# Altium project DB32.PRJPCB
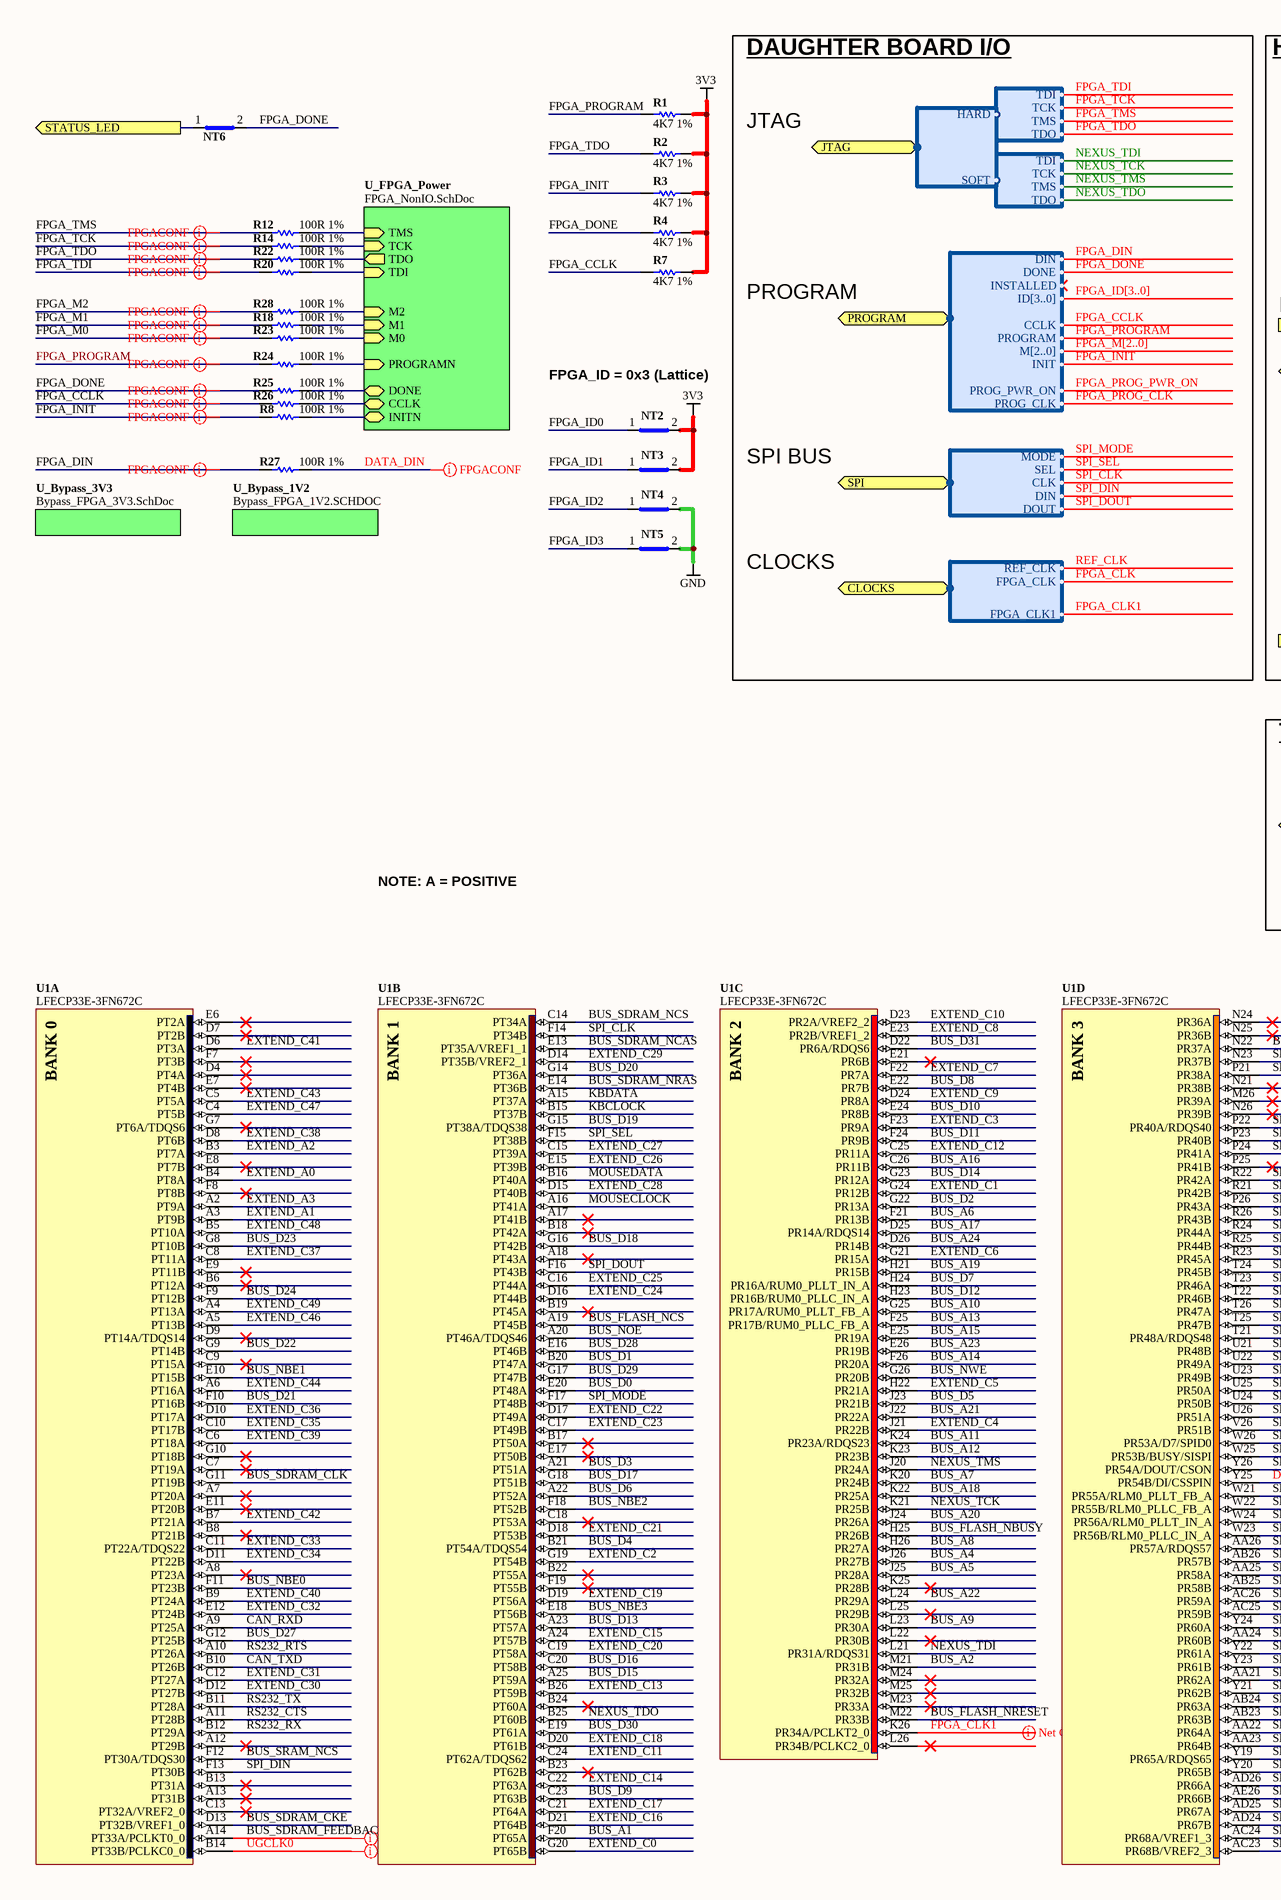
[diagram p0: FPGA.SCHDOC, left]
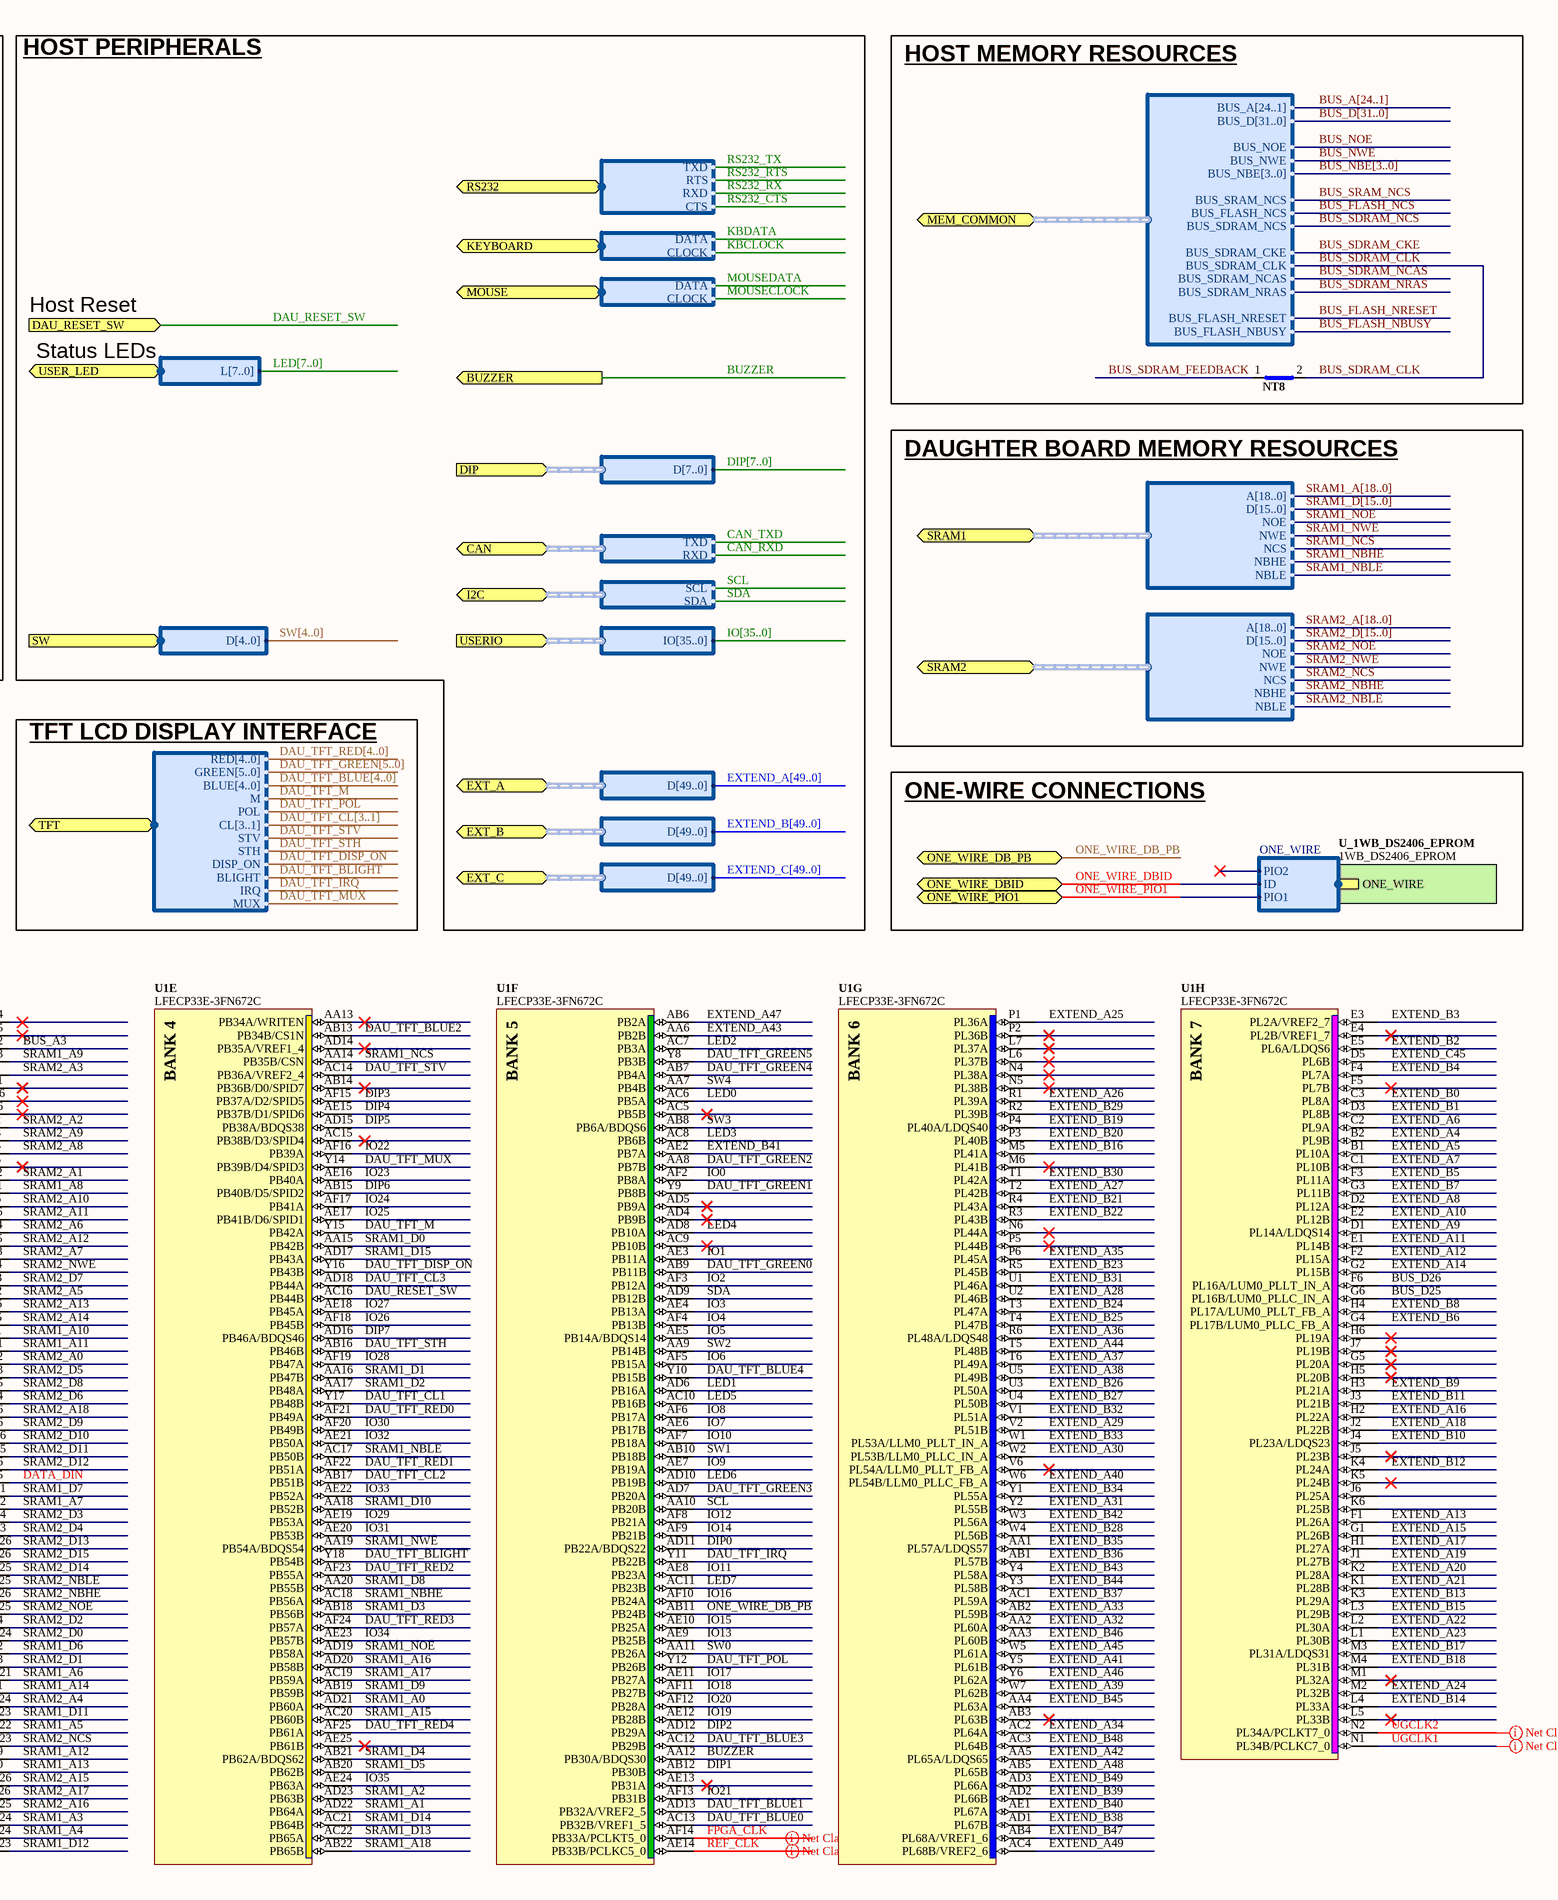
[diagram p1: FPGA.SCHDOC, right]
ProjectAddress1: L3, 12A Rodborough Road; ProjectAddress2: Frenchs Forest; ProjectAddress3: NSW 2086; ProjectAddress4: Australia; ProjectAssyNum: D-820-0006; ProjectOrganization: Altium Limited; ProjectRevision: 08; ProjectTitle: DB32 - Daughter Board Lattice; ProjectTotalSheets: 19
3 sheets, 96 parts. Net scope: hierarchical (ports join the sheet entries above them; power ports are global).
Board files: DB32.PcbDoc, DB32_Panel.PcbDoc
Sheets:
  FPGA.SCHDOC
    U_FPGA_Power = FPGA_NonIO.SchDoc
    U_Bypass_3V3 = Bypass_FPGA_3V3.SchDoc

## Sheet FPGA.SCHDOC: FPGA Connections
size A2; Organization: Altium Limited.; Address1: Level 3, 12a Rodborough Rd; Address2: Frenchs Forest 2086; Address3: NSW; Address4: AUSTRALIA; DocumentNumber: 3; SheetNumber: 4; SheetTotal: 21; PageSetup: Record=PageOptions|CenterHorizontal=True|CenterVertical=True|PrintScale=0.49|XCorrection=1.00|YCorrection=1.00|PrintKind=2|BorderSize=5000000|LeftOffset=0|BottomOffset=0|Orientation=2|PaperLength=1000|PaperWidth=1000|Scale=100|PaperSource=15|PrintQuality=600|MediaType=1|DitherType=10|PaperKind=A4|PrintScaleMode=1

### Parts
NT2  Net Tie SMT2  [NETTIE-SMT2-8X8]  (value not drawn)  (net tie, no BOM)
NT3  Net Tie SMT2  [NETTIE-SMT2-8X8]  (value not drawn)  (net tie, no BOM)
NT4  Net Tie SMT2  [NETTIE-SMT2-8X8]  (value not drawn)  (net tie, no BOM)
NT5  Net Tie SMT2  [NETTIE-SMT2-8X8]  (value not drawn)  (net tie, no BOM)
NT6  Net Tie SMT2  [NETTIE-SMT2-8X8]  (value not drawn)  (net tie, no BOM)
NT8  Net Tie SMT2  [NETTIE-SMT2-8X8]  (value not drawn)  (net tie, no BOM)
R1  4K7 1%  [RESC1005-STAR]
R2  4K7 1%  [RESC1005-STAR]
R3  4K7 1%  [RESC1005-STAR]
R4  4K7 1%  [RESC1005-STAR]
R7  4K7 1%  [RESC1005-STAR]
R8  100R 1%  [RESC1005-STAR]
R12  100R 1%  [RESC1005-STAR]
R14  100R 1%  [RESC1005-STAR]
R18  100R 1%  [RESC1005-STAR]
R20  100R 1%  [RESC1005-STAR]
R22  100R 1%  [RESC1005-STAR]
R23  100R 1%  [RESC1005-STAR]
R24  100R 1%  [RESC1005-STAR]
R25  100R 1%  [RESC1005-STAR]
R26  100R 1%  [RESC1005-STAR]
R27  100R 1%  [RESC1005-STAR]
R28  100R 1%  [RESC1005-STAR]
U1  LFECP33E-3FN672C  [BGA100P26X26-672]  (parts A,B,C,D,E,F,G,H of 12)

### Blocks framed on the sheet
HOST MEMORY RESOURCES: NT8

### Sub-sheets
U_1WB_DS2406_EPROM = 1WB_DS2406_EPROM (file not in this document): ONE_WIRE (harness ONE_WIRE)
U_Bypass_1V2 = Bypass_FPGA_1V2.SCHDOC (file not in this document): no entries
U_Bypass_3V3 = Bypass_FPGA_3V3.SchDoc: no entries
U_FPGA_Power = FPGA_NonIO.SchDoc: TMS (in), DONE (bidir), M1 (in), CCLK (bidir), M0 (in), M2 (in), TCK (in), INITN (bidir), TDI (in), PROGRAMN (in), TDO (out)

### Ports
BUZZER (out), CAN (harness CAN_INT), CLOCKS (harness DAU_CLK), DAU_RESET_SW (in), DIP (harness SW8), EXT_A (harness PBIO), EXT_B (harness PBIO), EXT_C (harness PBIO), I2C (harness I2C), JTAG (harness HARDSOFT_JTAG), KEYBOARD (harness PS2), MEM_COMMON (harness HOSTMEMORY), MOUSE (harness PS2), ONE_WIRE_DB_PB (bidir), ONE_WIRE_DBID (bidir), ONE_WIRE_PIO1 (bidir), PROGRAM (harness DAU_CTRL), RS232 (harness RS232_INT), SPI (harness DAU_SPI), SRAM1 (harness SRAM-256Kx16), SRAM2 (harness SRAM-256Kx16), STATUS_LED (out), SW (harness SW5), TFT (harness DAU_TFT), USER_LED (harness LED8), USERIO (harness IO36)

### Harnesses
ONE_WIRE: ID, PIO1, PIO2
SRAM-256Kx16: A[18..0], D[15..0], NCS, NWE, NOE, NBHE, NBLE
HOSTMEMORY: BUS_A[24..1], BUS_D[31..0], BUS_NOE, BUS_NWE, BUS_NBE[3..0], BUS_SRAM_NCS, BUS_FLASH_NCS, BUS_SDRAM_NCS, BUS_SDRAM_CKE, BUS_SDRAM_CLK, BUS_SDRAM_NCAS, BUS_SDRAM_NRAS, BUS_FLASH_NRESET, BUS_FLASH_NBUSY
DAU_CLK: REF_CLK, FPGA_CLK, FPGA_CLK1
DAU_SPI: MODE, SEL, CLK, DIN, DOUT
DAU_CTRL: DIN, DONE, INSTALLED, ID[3..0], CCLK, PROGRAM, M[2..0], INIT, PROG_PWR_ON, PROG_CLK
JTAG: TMS, TDO, TDI, TCK
HARDSOFT_JTAG: HARD, SOFT
LED8: L[7..0]
SW5: D[4..0]
DAU_TFT: RED[4..0], GREEN[5..0], BLUE[4..0], M, POL, CL[3..1], STV, STH, DISP_ON, BLIGHT, IRQ, MUX
PS2: DATA, CLOCK
RS232_INT: RXD, TXD, RTS, CTS
IO36: IO[35..0]
SW8: D[7..0]
CAN_INT: TXD, RXD
I2C: SCL, SDA
PBIO: D[49..0]

### Nets
3V3: NT2.2(Net2) NT3.2(Net2) R1.2 R2.2 R3.2 R4.2 R7.2
GND: NT4.2(Net2) NT5.2(Net2)
BUS_A1: U1.F20(PT65A)
BUS_A2: U1.M21(PR31B)
BUS_A3: U1.N22(PR37A)
BUS_A4: U1.J26(PR27B)
BUS_A5: U1.J25(PR28A)
BUS_A6: U1.F21(PR13B)
BUS_A7: U1.K20(PR24B)
BUS_A8: U1.H26(PR27A)
BUS_A9: U1.L23(PR30A)
BUS_A10: U1.G25(PR17A/RUM0_PLLT_FB_A)
BUS_A11: U1.K24(PR23A/RDQS23)
BUS_A12: U1.K23(PR23B)
BUS_A13: U1.F25(PR17B/RUM0_PLLC_FB_A)
BUS_A14: U1.F26(PR20A)
BUS_A15: U1.E25(PR19A)
BUS_A16: U1.C26(PR11B)
BUS_A17: U1.D25(PR14A/RDQS14)
BUS_A18: U1.K22(PR25A)
BUS_A19: U1.H21(PR15B)
BUS_A20: U1.J24(PR26A)
BUS_A21: U1.J22(PR22A)
BUS_A22: U1.L24(PR29A)
BUS_A23: U1.E26(PR19B)
BUS_A24: U1.D26(PR14B)
BUS_D0: U1.E20(PT48A)
BUS_D1: U1.B20(PT47A)
BUS_D2: U1.G22(PR13A)
BUS_D3: U1.A21(PT51A)
BUS_D4: U1.B21(PT54A/TDQS54)
BUS_D5: U1.J23(PR21B)
BUS_D6: U1.A22(PT52A)
BUS_D7: U1.H24(PR16A/RUM0_PLLT_IN_A)
BUS_D8: U1.E22(PR7B)
BUS_D9: U1.C23(PT63B)
BUS_D10: U1.E24(PR8B)
BUS_D11: U1.F24(PR9B)
BUS_D12: U1.H23(PR16B/RUM0_PLLC_IN_A)
BUS_D13: U1.A23(PT57A)
BUS_D14: U1.G23(PR12A)
BUS_D15: U1.A25(PT59A)
BUS_D16: U1.C20(PT58B)
BUS_D17: U1.G18(PT51B)
BUS_D18: U1.G16(PT42B)
BUS_D19: U1.G15(PT38A/TDQS38)
BUS_D20: U1.G14(PT36A)
BUS_D21: U1.F10(PT16B)
BUS_D22: U1.G9(PT14B)
BUS_D23: U1.G8(PT10B)
BUS_D24: U1.F9(PT12B)
BUS_D25: U1.G6(PL16B/LUM0_PLLC_IN_A)
BUS_D26: U1.F6(PL16A/LUM0_PLLT_IN_A)
BUS_D27: U1.G12(PT25B)
BUS_D28: U1.E16(PT46B)
BUS_D29: U1.G17(PT47B)
BUS_D30: U1.E19(PT61A)
BUS_D31: U1.D22(PR6A/RDQS6)
BUS_FLASH_NBUSY: U1.H25(PR26B) ; port MEM_COMMON.BUS_FLASH_NBUSY
BUS_FLASH_NCS: U1.A19(PT45B) ; port MEM_COMMON.BUS_FLASH_NCS
BUS_FLASH_NRESET: U1.M22(PR33B) ; port MEM_COMMON.BUS_FLASH_NRESET
BUS_NBE0: U1.F11(PT23B)
BUS_NBE1: U1.E10(PT15B)
BUS_NBE2: U1.F18(PT52B)
BUS_NBE3: U1.E18(PT56B)
BUS_NOE: U1.A20(PT46A/TDQS46) ; port MEM_COMMON.BUS_NOE
BUS_NWE: U1.G26(PR20B) ; port MEM_COMMON.BUS_NWE
BUS_SDRAM_CKE: U1.D13(PT32B/VREF1_0) ; port MEM_COMMON.BUS_SDRAM_CKE
BUS_SDRAM_CLK: NT8.2(Net2) U1.G11(PT19B) ; port MEM_COMMON.BUS_SDRAM_CLK
BUS_SDRAM_FEEDBACK: NT8.1(Net1) U1.A14(PT33A/PCLKT0_0)
BUS_SDRAM_NCAS: U1.E13(PT35A/VREF1_1) ; port MEM_COMMON.BUS_SDRAM_NCAS
BUS_SDRAM_NCS: U1.C14(PT34A) ; port MEM_COMMON.BUS_SDRAM_NCS
BUS_SDRAM_NRAS: U1.E14(PT36B) ; port MEM_COMMON.BUS_SDRAM_NRAS
BUS_SRAM_NCS: U1.F12(PT30A/TDQS30) ; port MEM_COMMON.BUS_SRAM_NCS
BUZZER: U1.AA12(PB30A/BDQS30) ; port BUZZER
CAN_RXD: U1.A9(PT25A) ; port CAN.RXD
CAN_TXD: U1.B10(PT26B) ; port CAN.TXD
CCLK: R26.2 ; sheet U_FPGA_Power/CCLK
DATA_DIN: R27.2 U1.Y25(PR54B/DI/CSSPIN)
DAU_RESET_SW: U1.AC16(PB44B) ; port DAU_RESET_SW
DAU_TFT_BLIGHT: U1.Y18(PB54B) ; port TFT.BLIGHT
DAU_TFT_BLUE0: U1.AC13(PB32B/VREF1_5)
DAU_TFT_BLUE1: U1.AD13(PB32A/VREF2_5)
DAU_TFT_BLUE2: U1.AB13(PB34B/CS1N)
DAU_TFT_BLUE3: U1.AC12(PB29B)
DAU_TFT_BLUE4: U1.Y10(PB15B)
DAU_TFT_CL1: U1.Y17(PB48B)
DAU_TFT_CL2: U1.AB17(PB51B)
DAU_TFT_CL3: U1.AD18(PB44A)
DAU_TFT_DISP_ON: U1.Y16(PB43B) ; port TFT.DISP_ON
DAU_TFT_GREEN0: U1.AB9(PB11B)
DAU_TFT_GREEN1: U1.Y9(PB8B)
DAU_TFT_GREEN2: U1.AA8(PB7B)
DAU_TFT_GREEN3: U1.AD7(PB20A)
DAU_TFT_GREEN4: U1.AB7(PB4A)
DAU_TFT_GREEN5: U1.Y8(PB3B)
DAU_TFT_IRQ: U1.Y11(PB22B) ; port TFT.IRQ
DAU_TFT_M: U1.Y15(PB42A) ; port TFT.M
DAU_TFT_MUX: U1.Y14(PB39B/D4/SPID3) ; port TFT.MUX
DAU_TFT_POL: U1.Y12(PB26B) ; port TFT.POL
DAU_TFT_RED0: U1.AF21(PB49A)
DAU_TFT_RED1: U1.AF22(PB51A)
DAU_TFT_RED2: U1.AF23(PB55A)
DAU_TFT_RED3: U1.AF24(PB57A)
DAU_TFT_RED4: U1.AF25(PB61A)
DAU_TFT_STH: U1.AB16(PB46B) ; port TFT.STH
DAU_TFT_STV: U1.AC14(PB36A/VREF2_4) ; port TFT.STV
DIP0: U1.AD11(PB22A/BDQS22)
DIP1: U1.AB12(PB30B)
DIP2: U1.AD12(PB29A)
DIP3: U1.AF15(PB37A/D2/SPID5)
DIP4: U1.AE15(PB37B/D1/SPID6)
DIP5: U1.AD15(PB38A/BDQS38)
DIP6: U1.AB15(PB40B/D5/SPID2)
DIP7: U1.AD16(PB46A/BDQS46)
DONE: R25.2 ; sheet U_FPGA_Power/DONE
EXTEND_A0: U1.B4(PT8A)
EXTEND_A1: U1.A3(PT9B)
EXTEND_A2: U1.B3(PT7A)
EXTEND_A3: U1.A2(PT9A)
EXTEND_A4: U1.B2(PL9B)
EXTEND_A5: U1.B1(PL10A)
EXTEND_A6: U1.C2(PL9A)
EXTEND_A7: U1.C1(PL10B)
EXTEND_A8: U1.D2(PL12A)
EXTEND_A9: U1.D1(PL14A/LDQS14)
EXTEND_A10: U1.E2(PL12B)
EXTEND_A11: U1.E1(PL14B)
EXTEND_A12: U1.F2(PL15A)
EXTEND_A13: U1.F1(PL26A)
EXTEND_A14: U1.G2(PL15B)
EXTEND_A15: U1.G1(PL26B)
EXTEND_A16: U1.H2(PL22A)
EXTEND_A17: U1.H1(PL27A)
EXTEND_A18: U1.J2(PL22B)
EXTEND_A19: U1.J1(PL27B)
EXTEND_A20: U1.K2(PL28A)
EXTEND_A21: U1.K1(PL28B)
EXTEND_A22: U1.L2(PL30A)
EXTEND_A23: U1.L1(PL30B)
EXTEND_A24: U1.M2(PL32B)
EXTEND_A25: U1.P1(PL36A)
EXTEND_A26: U1.R1(PL39A)
EXTEND_A27: U1.T2(PL42B)
EXTEND_A28: U1.U2(PL46B)
EXTEND_A29: U1.V2(PL51B)
EXTEND_A30: U1.W2(PL53B/LLM0_PLLC_IN_A)
EXTEND_A31: U1.Y2(PL55B)
EXTEND_A32: U1.AA2(PL60A)
EXTEND_A33: U1.AB2(PL59B)
EXTEND_A34: U1.AC2(PL64A)
EXTEND_A35: U1.P6(PL45A)
EXTEND_A36: U1.R6(PL48A/LDQS48)
EXTEND_A37: U1.T6(PL49A)
EXTEND_A38: U1.U5(PL49B)
EXTEND_A39: U1.W7(PL62B)
EXTEND_A40: U1.W6(PL54B/LLM0_PLLC_FB_A)
EXTEND_A41: U1.Y5(PL61B)
EXTEND_A42: U1.AA5(PL65A/LDQS65)
EXTEND_A43: U1.AA6(PB2B)
EXTEND_A44: U1.T5(PL48B)
EXTEND_A45: U1.W5(PL61A)
EXTEND_A46: U1.Y6(PL62A)
EXTEND_A47: U1.AB6(PB2A)
EXTEND_A48: U1.AB5(PL65B)
EXTEND_A49: U1.AC4(PL68B/VREF2_6)
EXTEND_B0: U1.C3(PL8A)
EXTEND_B1: U1.D3(PL8B)
EXTEND_B2: U1.E5(PL6A/LDQS6)
EXTEND_B3: U1.E3(PL2A/VREF2_7)
EXTEND_B4: U1.F4(PL7A)
EXTEND_B5: U1.F3(PL11A)
EXTEND_B6: U1.G4(PL17B/LUM0_PLLC_FB_A)
EXTEND_B7: U1.G3(PL11B)
EXTEND_B8: U1.H4(PL17A/LUM0_PLLT_FB_A)
EXTEND_B9: U1.H3(PL21A)
EXTEND_B10: U1.J4(PL23A/LDQS23)
EXTEND_B11: U1.J3(PL21B)
EXTEND_B12: U1.K4(PL24A)
EXTEND_B13: U1.K3(PL29A)
EXTEND_B14: U1.L4(PL33A)
EXTEND_B15: U1.L3(PL29B)
EXTEND_B16: U1.M5(PL41A)
EXTEND_B17: U1.M3(PL31A/LDQS31)
EXTEND_B18: U1.M4(PL31B)
EXTEND_B19: U1.P4(PL40A/LDQS40)
EXTEND_B20: U1.P3(PL40B)
EXTEND_B21: U1.R4(PL43A)
EXTEND_B22: U1.R3(PL43B)
EXTEND_B23: U1.R5(PL45B)
EXTEND_B24: U1.T3(PL47A)
EXTEND_B25: U1.T4(PL47B)
EXTEND_B26: U1.U3(PL50A)
EXTEND_B27: U1.U4(PL50B)
EXTEND_B28: U1.W4(PL56B)
EXTEND_B29: U1.R2(PL39B)
EXTEND_B30: U1.T1(PL42A)
EXTEND_B31: U1.U1(PL46A)
EXTEND_B32: U1.V1(PL51A)
EXTEND_B33: U1.W1(PL53A/LLM0_PLLT_IN_A)
EXTEND_B34: U1.Y1(PL55A)
EXTEND_B35: U1.AA1(PL57A/LDQS57)
EXTEND_B36: U1.AB1(PL57B)
EXTEND_B37: U1.AC1(PL59A)
EXTEND_B38: U1.AD1(PL67B)
EXTEND_B39: U1.AD2(PL66B)
EXTEND_B40: U1.AE1(PL67A)
EXTEND_B41: U1.AE2(PB7A)
EXTEND_B42: U1.W3(PL56A)
EXTEND_B43: U1.Y4(PL58A)
EXTEND_B44: U1.Y3(PL58B)
EXTEND_B45: U1.AA4(PL63A)
EXTEND_B46: U1.AA3(PL60B)
EXTEND_B47: U1.AB4(PL68A/VREF1_6)
EXTEND_B48: U1.AC3(PL64B)
EXTEND_B49: U1.AD3(PL66A)
EXTEND_C0: U1.G20(PT65B)
EXTEND_C1: U1.G24(PR12B)
EXTEND_C2: U1.G19(PT54B)
EXTEND_C3: U1.F23(PR9A)
EXTEND_C4: U1.J21(PR22B)
EXTEND_C5: U1.H22(PR21A)
EXTEND_C6: U1.G21(PR15A)
EXTEND_C7: U1.F22(PR7A)
EXTEND_C8: U1.E23(PR2B/VREF1_2)
EXTEND_C9: U1.D24(PR8A)
EXTEND_C10: U1.D23(PR2A/VREF2_2)
EXTEND_C11: U1.C24(PT62A/TDQS62)
EXTEND_C12: U1.C25(PR11A)
EXTEND_C13: U1.B26(PT59B)
EXTEND_C14: U1.C22(PT63A)
EXTEND_C15: U1.A24(PT57B)
EXTEND_C16: U1.D21(PT64B)
EXTEND_C17: U1.C21(PT64A)
EXTEND_C18: U1.D20(PT61B)
EXTEND_C19: U1.D19(PT56A)
EXTEND_C20: U1.C19(PT58A)
EXTEND_C21: U1.D18(PT53B)
EXTEND_C22: U1.D17(PT49A)
EXTEND_C23: U1.C17(PT49B)
EXTEND_C24: U1.D16(PT44B)
EXTEND_C25: U1.C16(PT44A)
EXTEND_C26: U1.E15(PT39B)
EXTEND_C27: U1.C15(PT39A)
EXTEND_C28: U1.D15(PT40B)
EXTEND_C29: U1.D14(PT35B/VREF2_1)
EXTEND_C30: U1.D12(PT27B)
EXTEND_C31: U1.C12(PT27A)
EXTEND_C32: U1.E12(PT24B)
EXTEND_C33: U1.C11(PT22A/TDQS22)
EXTEND_C34: U1.D11(PT22B)
EXTEND_C35: U1.C10(PT17B)
EXTEND_C36: U1.D10(PT17A)
EXTEND_C37: U1.C8(PT11A)
EXTEND_C38: U1.D8(PT6B)
EXTEND_C39: U1.C6(PT18A)
EXTEND_C40: U1.B9(PT24A)
EXTEND_C41: U1.D6(PT3A)
EXTEND_C42: U1.B7(PT21A)
EXTEND_C43: U1.C5(PT5A)
EXTEND_C44: U1.A6(PT16A)
EXTEND_C45: U1.D5(PL6B)
EXTEND_C46: U1.A5(PT13B)
EXTEND_C47: U1.C4(PT5B)
EXTEND_C48: U1.B5(PT10A)
EXTEND_C49: U1.A4(PT13A)
FPGA_CCLK: R7.1 R26.1 ; port PROGRAM.CCLK
FPGA_CLK: U1.AF14(PB33A/PCLKT5_0) ; port CLOCKS.FPGA_CLK
FPGA_CLK1: U1.K26(PR34A/PCLKT2_0) ; port CLOCKS.FPGA_CLK1
FPGA_DIN: R27.1 ; port PROGRAM.DIN
FPGA_DONE: NT6.2(Net2) R4.1 R25.1 ; port PROGRAM.DONE
FPGA_ID0: NT2.1(Net1)
FPGA_ID1: NT3.1(Net1)
FPGA_ID2: NT4.1(Net1)
FPGA_ID3: NT5.1(Net1)
FPGA_INIT: R3.1 R8.1 ; port PROGRAM.INIT
FPGA_M0: R23.1
FPGA_M1: R18.1
FPGA_M2: R28.1
FPGA_PROG_CLK: port PROGRAM.PROG_CLK
FPGA_PROG_PWR_ON: port PROGRAM.PROG_PWR_ON
FPGA_PROGRAM: R1.1 R24.1 ; port PROGRAM.PROGRAM
FPGA_TCK: R14.1 ; harness JTAG.TCK
FPGA_TDI: R20.1 ; harness JTAG.TDI
FPGA_TDO: R2.1 R22.1 ; harness JTAG.TDO
FPGA_TMS: R12.1 ; harness JTAG.TMS
INITN: R8.2 ; sheet U_FPGA_Power/INITN
IO0: U1.AF2(PB8A)
IO1: U1.AE3(PB11A)
IO2: U1.AF3(PB12A)
IO3: U1.AE4(PB13A)
IO4: U1.AF4(PB13B)
IO5: U1.AE5(PB14A/BDQS14)
IO6: U1.AF5(PB15A)
IO7: U1.AE6(PB17B)
IO8: U1.AF6(PB17A)
IO9: U1.AE7(PB19A)
IO10: U1.AF7(PB18A)
IO11: U1.AE8(PB23A)
IO12: U1.AF8(PB21A)
IO13: U1.AE9(PB25B)
IO14: U1.AF9(PB21B)
IO15: U1.AE10(PB25A)
IO16: U1.AF10(PB24A)
IO17: U1.AE11(PB27A)
IO18: U1.AF11(PB27B)
IO19: U1.AE12(PB28B)
IO20: U1.AF12(PB28A)
IO21: U1.AF13(PB31B)
IO22: U1.AF16(PB39A)
IO23: U1.AE16(PB40A)
IO24: U1.AF17(PB41A)
IO25: U1.AE17(PB41B/D6/SPID1)
IO26: U1.AF18(PB45B)
IO27: U1.AE18(PB45A)
IO28: U1.AF19(PB47A)
IO29: U1.AE19(PB53A)
IO30: U1.AF20(PB49B)
IO31: U1.AE20(PB53B)
IO32: U1.AE21(PB50A)
IO33: U1.AE22(PB52A)
IO34: U1.AE23(PB57B)
IO35: U1.AE24(PB63A)
KBCLOCK: U1.B15(PT37B) ; port KEYBOARD.CLOCK
KBDATA: U1.A15(PT37A) ; port KEYBOARD.DATA
LED0: U1.AC6(PB5A)
LED1: U1.AD6(PB16A)
LED2: U1.AC7(PB3A)
LED3: U1.AC8(PB6B)
LED4: U1.AD8(PB10A)
LED5: U1.AC10(PB16B)
LED6: U1.AD10(PB19B)
LED7: U1.AC11(PB23B)
M0: R23.2 ; sheet U_FPGA_Power/M0
M1: R18.2 ; sheet U_FPGA_Power/M1
M2: R28.2 ; sheet U_FPGA_Power/M2
MOUSECLOCK: U1.A16(PT41A) ; port MOUSE.CLOCK
MOUSEDATA: U1.B16(PT40A) ; port MOUSE.DATA
NEXUS_TCK: U1.K21(PR25B) ; harness JTAG.TCK
NEXUS_TDI: U1.L21(PR31A/RDQS31) ; harness JTAG.TDI
NEXUS_TDO: U1.B25(PT60B) ; harness JTAG.TDO
NEXUS_TMS: U1.J20(PR24A) ; harness JTAG.TMS
ONE_WIRE_DB_PB: U1.AB11(PB24B) ; port ONE_WIRE_DB_PB
ONE_WIRE_DBID: port ONE_WIRE_DBID, sheet U_1WB_DS2406_EPROM/ONE_WIRE.ID
ONE_WIRE_PIO1: port ONE_WIRE_PIO1, sheet U_1WB_DS2406_EPROM/ONE_WIRE.PIO1
PROGRAMN: R24.2 ; sheet U_FPGA_Power/PROGRAMN
REF_CLK: U1.AE14(PB33B/PCLKC5_0) ; port CLOCKS.REF_CLK
RS232_CTS: U1.A11(PT28B) ; port RS232.CTS
RS232_RTS: U1.A10(PT26A) ; port RS232.RTS
RS232_RX: U1.B12(PT29A) ; port RS232.RXD
RS232_TX: U1.B11(PT28A) ; port RS232.TXD
SCL: U1.AA10(PB20B) ; port I2C.SCL
SDA: U1.AD9(PB12B) ; port I2C.SDA
SPI_CLK: U1.F14(PT34B) ; port SPI.CLK
SPI_DIN: U1.F13(PT30B) ; port SPI.DIN
SPI_DOUT: U1.F16(PT43B) ; port SPI.DOUT
SPI_MODE: U1.F17(PT48B) ; port SPI.MODE
SPI_SEL: U1.F15(PT38B) ; port SPI.SEL
SRAM1_A0: U1.AD21(PB60A)
SRAM1_A1: U1.AD22(PB64A)
SRAM1_A2: U1.AD23(PB63B)
SRAM1_A3: U1.AD24(PR67B)
SRAM1_A4: U1.AC24(PR68A/VREF1_3)
SRAM1_A5: U1.AA22(PR64A)
SRAM1_A6: U1.AA21(PR62A)
SRAM1_A7: U1.W22(PR55B/RLM0_PLLC_FB_A)
SRAM1_A8: U1.R21(PR42B)
SRAM1_A9: U1.N23(PR37B)
SRAM1_A10: U1.T21(PR48A/RDQS48)
SRAM1_A11: U1.U21(PR48B)
SRAM1_A12: U1.Y19(PR65A/RDQS65)
SRAM1_A13: U1.Y20(PR65B)
SRAM1_A14: U1.Y21(PR62B)
SRAM1_A15: U1.AC20(PB60B)
SRAM1_A16: U1.AD20(PB58B)
SRAM1_A17: U1.AC19(PB59A)
SRAM1_A18: U1.AB22(PB65B)
SRAM1_D0: U1.AA15(PB42B)
SRAM1_D1: U1.AA16(PB47B)
SRAM1_D2: U1.AA17(PB48A)
SRAM1_D3: U1.AB18(PB56B)
SRAM1_D4: U1.AB21(PB62A/BDQS62)
SRAM1_D5: U1.AB20(PB62B)
SRAM1_D6: U1.Y22(PR61A)
SRAM1_D7: U1.W21(PR55A/RLM0_PLLT_FB_A)
SRAM1_D8: U1.AA20(PB55B)
SRAM1_D9: U1.AB19(PB59B)
SRAM1_D10: U1.AA18(PB52B)
SRAM1_D11: U1.AB23(PR63B)
SRAM1_D12: U1.AC23(PR68B/VREF2_3)
SRAM1_D13: U1.AC22(PB65A)
SRAM1_D14: U1.AC21(PB64B)
SRAM1_D15: U1.AD17(PB43A)
SRAM1_NBHE: U1.AC18(PB56A) ; port SRAM1.NBHE
SRAM1_NBLE: U1.AC17(PB50B) ; port SRAM1.NBLE
SRAM1_NCS: U1.AA14(PB35B/CSN) ; port SRAM1.NCS
SRAM1_NOE: U1.AD19(PB58A) ; port SRAM1.NOE
SRAM1_NWE: U1.AA19(PB54A/BDQS54) ; port SRAM1.NWE
SRAM2_A0: U1.U22(PR49A)
SRAM2_A1: U1.R22(PR42A)
SRAM2_A2: U1.P22(PR40A/RDQS40)
SRAM2_A3: U1.P21(PR38A)
SRAM2_A4: U1.AB24(PR63A)
SRAM2_A5: U1.T22(PR46B)
SRAM2_A6: U1.R24(PR44A)
SRAM2_A7: U1.R23(PR45A)
SRAM2_A8: U1.P24(PR41A)
SRAM2_A9: U1.P23(PR40B)
SRAM2_A10: U1.P26(PR43A)
SRAM2_A11: U1.R26(PR43B)
SRAM2_A12: U1.R25(PR44B)
SRAM2_A13: U1.T26(PR47A)
SRAM2_A14: U1.T25(PR47B)
SRAM2_A15: U1.AD26(PR66A)
SRAM2_A16: U1.AD25(PR67A)
SRAM2_A17: U1.AE26(PR66B)
SRAM2_A18: U1.U26(PR51A)
SRAM2_D0: U1.AA24(PR60B)
SRAM2_D1: U1.Y23(PR61B)
SRAM2_D2: U1.Y24(PR60A)
SRAM2_D3: U1.W24(PR56A/RLM0_PLLT_IN_A)
SRAM2_D4: U1.W23(PR56B/RLM0_PLLC_IN_A)
SRAM2_D5: U1.U23(PR49B)
SRAM2_D6: U1.U24(PR50B)
SRAM2_D7: U1.T23(PR46A)
SRAM2_D8: U1.U25(PR50A)
SRAM2_D9: U1.V26(PR51B)
SRAM2_D10: U1.W26(PR53A/D7/SPID0)
SRAM2_D11: U1.W25(PR53B/BUSY/SISPI)
SRAM2_D12: U1.Y26(PR54A/DOUT/CSON)
SRAM2_D13: U1.AA26(PR57A/RDQS57)
SRAM2_D14: U1.AA25(PR58A)
SRAM2_D15: U1.AB26(PR57B)
SRAM2_NBHE: U1.AC26(PR59A) ; port SRAM2.NBHE
SRAM2_NBLE: U1.AB25(PR58B) ; port SRAM2.NBLE
SRAM2_NCS: U1.AA23(PR64B) ; port SRAM2.NCS
SRAM2_NOE: U1.AC25(PR59B) ; port SRAM2.NOE
SRAM2_NWE: U1.T24(PR45B) ; port SRAM2.NWE
STATUS_LED: NT6.1(Net1) ; port STATUS_LED
SW0: U1.AA11(PB26A)
SW1: U1.AB10(PB18B)
SW2: U1.AA9(PB14B)
SW3: U1.AB8(PB6A/BDQS6)
SW4: U1.AA7(PB4B)
TCK: R14.2 ; sheet U_FPGA_Power/TCK
TDI: R20.2 ; sheet U_FPGA_Power/TDI
TDO: R22.2 ; sheet U_FPGA_Power/TDO
TMS: R12.2 ; sheet U_FPGA_Power/TMS
UGCLK0: U1.B14(PT33B/PCLKC0_0)
UGCLK1: U1.N1(PL34B/PCLKC7_0)
UGCLK2: U1.N2(PL34A/PCLKT7_0)

Not connected (* = marked no-connect by the designer): U1 A7(PT20A)* A8(PT23A)* A12(PT29B)* A13(PT31B)* A17(PT41B)* A18(PT43A)* AA13(PB34A/WRITEN)* AB3(PL63B)* AB14(PB36B/D0/SPID7)* AC5(PB5B)* AC9(PB10B)* AC15(PB38B/D3/SPID4)* AD4(PB9B)* AD5(PB9A)* AD14(PB35A/VREF1_4)* AE13(PB31A)* AE25(PB61B)* B6(PT12A)* B8(PT21B)* B13(PT31A)* B17(PT50A)* B18(PT42A)* B19(PT45A)* B22(PT55A)* B23(PT62B)* B24(PT60A)* C7(PT19A)* C9(PT15A)* C13(PT32A/VREF2_0)* C18(PT53A)* D4(PT4A)* D7(PT2B)* D9(PT14A/TDQS14)* E4(PL2B/VREF1_7)* E6(PT2A)* E7(PT4B)* E8(PT7B)* E9(PT11B)* E11(PT20B)* E17(PT50B)* E21(PR6B)* F5(PL7B)* F7(PT3B)* F8(PT8B)* F19(PT55B)* G5(PL20A)* G7(PT6A/TDQS6)* G10(PT18B)* H5(PL20B)* H6(PL19A)* J5(PL23B)* J6(PL25A) J7(PL19B)* K5(PL24B)* K6(PL25B) K25(PR28B)* L5(PL33B)* L6(PL37B)* L7(PL37A)* L22(PR30B)* L25(PR29B)* L26(PR34B/PCLKC2_0)* M1(PL32A)* M6(PL41B)* M23(PR33A)* M24(PR32A)* M25(PR32B)* M26(PR39A)* N4(PL38A)* N5(PL38B)* N6(PL44A)* N21(PR38B)* N24(PR36A)* N25(PR36B)* N26(PR39B)* P2(PL36B)* P5(PL44B)* P25(PR41B)* V6(PL54A/LLM0_PLLT_FB_A)*

### Buses and harness runs
bus BUS_A[24..1]
bus BUS_D[31..0]
bus BUS_NBE[3..0]
bus DAU_TFT_BLUE[4..0]
bus DAU_TFT_CL[3..1]
bus DAU_TFT_GREEN[5..0]
bus DAU_TFT_RED[4..0]
bus DIP[7..0]
bus EXTEND_A[49..0]
bus EXTEND_B[49..0]
bus EXTEND_C[49..0]
bus FPGA_ID[3..0]
bus FPGA_M[2..0]
bus IO[35..0]
bus LED[7..0]
bus SRAM1_A[18..0]
bus SRAM1_D[15..0]
bus SRAM2_A[18..0]
bus SRAM2_D[15..0]
bus SW[4..0]

### Layout directives
net class CLKS: BUS_SDRAM_FEEDBACK, FPGA_CLK, FPGA_CLK1, REF_CLK, UGCLK0, UGCLK1, UGCLK2
net class FPGACONF: DATA_DIN, FPGA_CCLK, FPGA_DIN, FPGA_DONE, FPGA_INIT, FPGA_M0, FPGA_M1, FPGA_M2, FPGA_PROGRAM, FPGA_TCK, FPGA_TDI, FPGA_TDO, FPGA_TMS

### Notes on the sheet
- DAUGHTER BOARD I/O
- HOST PERIPHERALS
- JTAG
- PROGRAM
- Host Reset
- (near NT2) FPGA_ID = 0x3 (Lattice)
- Status LEDs
- SPI BUS
- DAUGHTER BOARD MEMORY RESOURCES
- CLOCKS
- TFT LCD DISPLAY INTERFACE
- ONE-WIRE CONNECTIONS
- NOTE: A = POSITIVE
- Project Title
- Sheet Title
- Size:
- Date:
- File:
- A2
- Assy:
- Time:
- Revision:
- Sheet
- of
- (in symbol D-241-0003, part A) BANK 0
- (in symbol D-241-0003, part B) BANK 1
- (in symbol D-241-0003, part C) BANK 2
- (in symbol D-241-0003, part D) BANK 3
- (in symbol D-241-0003, part E) BANK 4
- (in symbol D-241-0003, part F) BANK 5
- (in symbol D-241-0003, part G) BANK 6
- (in symbol D-241-0003, part H) BANK 7

### Library data of the parts
NT2-NT6 NT8 = D-002-0002: Net-Tie, Surface Mount, 2 x 0.4mm x 0.2mm SMT Pads - For 0.2mm Track; Status: Production; Category: Net-Tie
R1-R4 R7 = D-100-0088: Resistor, 4K7 1% 0402 (1005); Power Rating: 63 mW; Resistance: 4.7 K; Mounting Technology: Surface Mount; Status: Production; Tolerance: 1 %; Category: Resistor
R8 R12 R14 R18 R20 R22-R28 = D-100-0131: Resistor, 100R 1% 0402 (1005); Power Rating: 63 mW; Mounting Technology: Surface Mount; Resistance: 100 R; Status: Production; Tolerance: 1 %; Category: Resistor
U1 = D-241-0003: FPGA, Lattice ECP-35 FN672; Supply Voltage: mV; Mounting Technology: Surface Mount; Status: Production; Technology: None; Category: IC-FPGA

## Sheet FPGA_NonIO.SchDoc: FPGA Power and Programming
size A4; Organization: Altium Limited.; Address1: Level 3, 12a Rodborough Rd; Address2: Frenchs Forest 2086; Address3: NSW; Address4: AUSTRALIA; DocumentNumber: 7; SheetNumber: 7; SheetTotal: 21; PageSetup: Record=PageOptions|CenterHorizontal=True|CenterVertical=True|PrintScale=0.97|XCorrection=1.00|YCorrection=1.00|PrintKind=2|BorderSize=5000000|LeftOffset=0|BottomOffset=0|Orientation=2|PaperLength=1000|PaperWidth=1000|Scale=100|PaperSource=15|PrintQuality=600|MediaType=1|DitherType=10|PaperKind=A4|PrintScaleMode=1
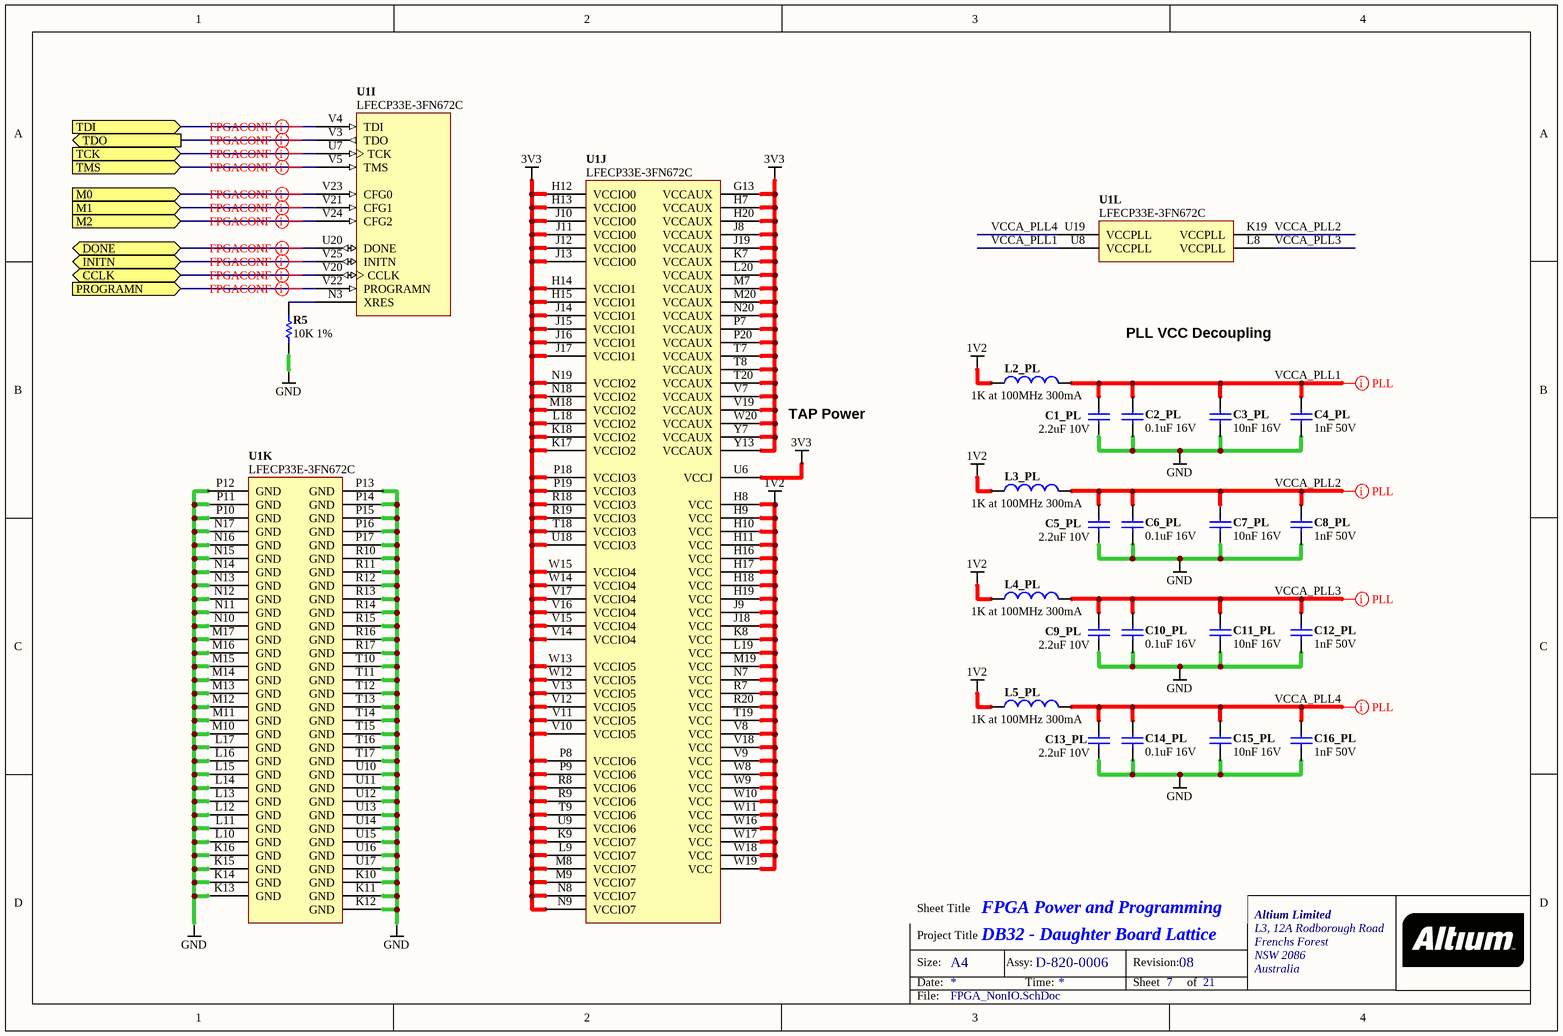
[diagram p2: FPGA_NonIO.SchDoc]

### Parts
C1_PL  2.2uF 10V  [CAPC1608-STAR]
C2_PL  0.1uF 16V  [CAPC1005-STAR]
C3_PL  10nF 16V  [CAPC1005-STAR]
C4_PL  1nF 50V  [CAPC1005-STAR]
C5_PL  2.2uF 10V  [CAPC1608-STAR]
C6_PL  0.1uF 16V  [CAPC1005-STAR]
C7_PL  10nF 16V  [CAPC1005-STAR]
C8_PL  1nF 50V  [CAPC1005-STAR]
C9_PL  2.2uF 10V  [CAPC1608-STAR]
C10_PL  0.1uF 16V  [CAPC1005-STAR]
C11_PL  10nF 16V  [CAPC1005-STAR]
C12_PL  1nF 50V  [CAPC1005-STAR]
C13_PL  2.2uF 10V  [CAPC1608-STAR]
C14_PL  0.1uF 16V  [CAPC1005-STAR]
C15_PL  10nF 16V  [CAPC1005-STAR]
C16_PL  1nF 50V  [CAPC1005-STAR]
L2_PL  1K at 100MHz 300mA  [INDC2012-STAR]
L3_PL  1K at 100MHz 300mA  [INDC2012-STAR]
L4_PL  1K at 100MHz 300mA  [INDC2012-STAR]
L5_PL  1K at 100MHz 300mA  [INDC2012-STAR]
R5  10K 1%  [RESC1005-STAR]
U1  LFECP33E-3FN672C  [BGA100P26X26-672]  (parts I,J,K,L of 12)

### Ports
CCLK (bidir), DONE (bidir), INITN (bidir), M0 (in), M1 (in), M2 (in), PROGRAMN (in), TCK (in), TDI (in), TDO (out), TMS (in)

### Nets
1V2: L2_PL.1 L3_PL.1 L4_PL.1 L5_PL.1 U1.H8(VCC) U1.H9(VCC) U1.H10(VCC) U1.H11(VCC) U1.H16(VCC) U1.H17(VCC) U1.H18(VCC) U1.H19(VCC) U1.J9(VCC) U1.J18(VCC) U1.K8(VCC) U1.L19(VCC) U1.M19(VCC) U1.N7(VCC) U1.R7(VCC) U1.R20(VCC) U1.T19(VCC) U1.V8(VCC) U1.V9(VCC) U1.V18(VCC) U1.W8(VCC) U1.W9(VCC) U1.W10(VCC) U1.W11(VCC) U1.W16(VCC) U1.W17(VCC) U1.W18(VCC) U1.W19(VCC)
3V3: U1.G13(VCCAUX) U1.H7(VCCAUX) U1.H12(VCCIO0) U1.H13(VCCIO0) U1.H14(VCCIO1) U1.H15(VCCIO1) U1.H20(VCCAUX) U1.J8(VCCAUX) U1.J10(VCCIO0) U1.J11(VCCIO0) U1.J12(VCCIO0) U1.J13(VCCIO0) U1.J14(VCCIO1) U1.J15(VCCIO1) U1.J16(VCCIO1) U1.J17(VCCIO1) U1.J19(VCCAUX) U1.K7(VCCAUX) U1.K9(VCCIO7) U1.K17(VCCIO2) U1.K18(VCCIO2) U1.L9(VCCIO7) U1.L18(VCCIO2) U1.L20(VCCAUX) U1.M7(VCCAUX) U1.M8(VCCIO7) U1.M9(VCCIO7) U1.M18(VCCIO2) U1.M20(VCCAUX) U1.N8(VCCIO7) U1.N9(VCCIO7) U1.N18(VCCIO2) U1.N19(VCCIO2) U1.N20(VCCAUX) U1.P7(VCCAUX) U1.P8(VCCIO6) U1.P9(VCCIO6) U1.P18(VCCIO3) U1.P19(VCCIO3) U1.P20(VCCAUX) U1.R8(VCCIO6) U1.R9(VCCIO6) U1.R18(VCCIO3) U1.R19(VCCIO3) U1.T7(VCCAUX) U1.T8(VCCAUX) U1.T9(VCCIO6) U1.T18(VCCIO3) U1.T20(VCCAUX) U1.U6(VCCJ) U1.U9(VCCIO6) U1.U18(VCCIO3) U1.V7(VCCAUX) U1.V10(VCCIO5) U1.V11(VCCIO5) U1.V12(VCCIO5) U1.V13(VCCIO5) U1.V14(VCCIO4) U1.V15(VCCIO4) U1.V16(VCCIO4) U1.V17(VCCIO4) U1.V19(VCCAUX) U1.W12(VCCIO5) U1.W13(VCCIO5) U1.W14(VCCIO4) U1.W15(VCCIO4) U1.W20(VCCAUX) U1.Y7(VCCAUX) U1.Y13(VCCAUX)
GND: C1_PL.2 C2_PL.2 C3_PL.2 C4_PL.2 C5_PL.2 C6_PL.2 C7_PL.2 C8_PL.2 C9_PL.2 C10_PL.2 C11_PL.2 C12_PL.2 C13_PL.2 C14_PL.2 C15_PL.2 C16_PL.2 R5.2 U1.K10(GND) U1.K11(GND) U1.K12(GND) U1.K13(GND) U1.K14(GND) U1.K15(GND) U1.K16(GND) U1.L10(GND) U1.L11(GND) U1.L12(GND) U1.L13(GND) U1.L14(GND) U1.L15(GND) U1.L16(GND) U1.L17(GND) U1.M10(GND) U1.M11(GND) U1.M12(GND) U1.M13(GND) U1.M14(GND) U1.M15(GND) U1.M16(GND) U1.M17(GND) U1.N10(GND) U1.N11(GND) U1.N12(GND) U1.N13(GND) U1.N14(GND) U1.N15(GND) U1.N16(GND) U1.N17(GND) U1.P10(GND) U1.P11(GND) U1.P12(GND) U1.P13(GND) U1.P14(GND) U1.P15(GND) U1.P16(GND) U1.P17(GND) U1.R10(GND) U1.R11(GND) U1.R12(GND) U1.R13(GND) U1.R14(GND) U1.R15(GND) U1.R16(GND) U1.R17(GND) U1.T10(GND) U1.T11(GND) U1.T12(GND) U1.T13(GND) U1.T14(GND) U1.T15(GND) U1.T16(GND) U1.T17(GND) U1.U10(GND) U1.U11(GND) U1.U12(GND) U1.U13(GND) U1.U14(GND) U1.U15(GND) U1.U16(GND) U1.U17(GND)
CCLK: U1.V20(CCLK) ; port CCLK
DONE: U1.U20(DONE) ; port DONE
INITN: U1.V25(INITN) ; port INITN
M0: U1.V23(CFG0) ; port M0
M1: U1.V21(CFG1) ; port M1
M2: U1.V24(CFG2) ; port M2
PROGRAMN: U1.V22(PROGRAMN) ; port PROGRAMN
TCK: U1.U7(TCK) ; port TCK
TDI: U1.V4(TDI) ; port TDI
TDO: U1.V3(TDO) ; port TDO
TMS: U1.V5(TMS) ; port TMS
VCCA_PLL1: C1_PL.1 C2_PL.1 C3_PL.1 C4_PL.1 L2_PL.2 U1.U8(VCCPLL)
VCCA_PLL2: C5_PL.1 C6_PL.1 C7_PL.1 C8_PL.1 L3_PL.2 U1.K19(VCCPLL)
VCCA_PLL3: C9_PL.1 C10_PL.1 C11_PL.1 C12_PL.1 L4_PL.2 U1.L8(VCCPLL)
VCCA_PLL4: C13_PL.1 C14_PL.1 C15_PL.1 C16_PL.1 L5_PL.2 U1.U19(VCCPLL)
NetR5_1: R5.1 U1.N3(XRES)

### Layout directives
net class FPGACONF: CCLK, DONE, INITN, M0, M1, M2, PROGRAMN, TCK, TDI, TDO, TMS
net class PLL: VCCA_PLL1, VCCA_PLL2, VCCA_PLL3, VCCA_PLL4

### Notes on the sheet
- PLL VCC Decoupling
- TAP Power
- Sheet Title
- Project Title
- Size:
- Date:
- A4
- Assy:
- Time:
- Revision:
- Sheet
- of
- File:

### Library data of the parts
C1_PL C5_PL C9_PL C13_PL = D-101-0095: Capacitor, Ceramic, 2.2uF 10% 10V 0603 (1608) X5R; Polarity: Non-Polarized; Capacitance: 2.2 uF; Dielectric: X5R; Mounting Technology: Surface Mount; Rated Voltage: 10 V; Status: Unreleased; Technology: Ceramic; Tolerance: 10 %; Category: Capacitor
C2_PL C6_PL C10_PL C14_PL = D-101-0080: Capacitor, Ceramic, 0.1uF 10% 16V 0402 (1005) X7R; Polarity: Non-Polarized; Capacitance: 0.1 uF; Dielectric: X7R; Mounting Technology: Surface Mount; Rated Voltage: 16 V; Status: Production; Technology: Ceramic; Tolerance: 10 %; Category: Capacitor
C3_PL C7_PL C11_PL C15_PL = D-101-0077: Capacitor, Ceramic, 10nF 10% 16V 0402 (1005) X7R; Polarity: Non-Polarized; Capacitance: 10 nF; Dielectric: X7R; Mounting Technology: Surface Mount; Rated Voltage: 16 V; Status: Production; Technology: Ceramic; Tolerance: 10 %; Category: Capacitor
C4_PL C8_PL C12_PL C16_PL = D-101-0030: Capacitor, Ceramic, 1nF 10% 50V 0402 (1005) X7R; Polarity: Non-Polarized; Capacitance: 1 nF; Dielectric: X7R; Mounting Technology: Surface Mount; Rated Voltage: 50 V; Status: Production; Technology: Ceramic; Tolerance: 10 %; Category: Capacitor
L2_PL L3_PL L4_PL L5_PL = D-102-0002: Inductor, Ferrite Bead 1K@100MHz 300mA 0805 (2012) BMB2A1000LN2; Inductance: nH; Max Input Current: 300 mA; Mounting Technology: Surface Mount; Status: Production; Category: Inductor
R5 = D-100-0130: Resistor, 10K 1% 0402 (1005); Power Rating: 63 mW; Mounting Technology: Surface Mount; Resistance: 10 K; Status: Production; Tolerance: 1 %; Category: Resistor
U1 = D-241-0003: as U1 on sheet FPGA; Mounting Technology: Surface Mount; Status: Production; Technology: None; Category: IC-FPGA

## Sheet Bypass_FPGA_3V3.SchDoc: FPGA Bypass Capacitors for 3V3
size A4; Organization: Altium Limited.; Address1: Level 3, 12a Rodborough Rd; Address2: Frenchs Forest 2086; Address3: NSW; Address4: AUSTRALIA; DocumentNumber: 6; SheetNumber: 6; SheetTotal: 21; PageSetup: Record=PageOptions|CenterHorizontal=True|CenterVertical=True|PrintScale=0.97|XCorrection=1.00|YCorrection=1.00|PrintKind=1|BorderSize=5000000|LeftOffset=0|BottomOffset=0|Orientation=2|PaperLength=1000|PaperWidth=1000|Scale=100|PaperSource=262|PrintQuality=600|MediaType=1|DitherType=10|PaperKind=A4|PrintScaleMode=1
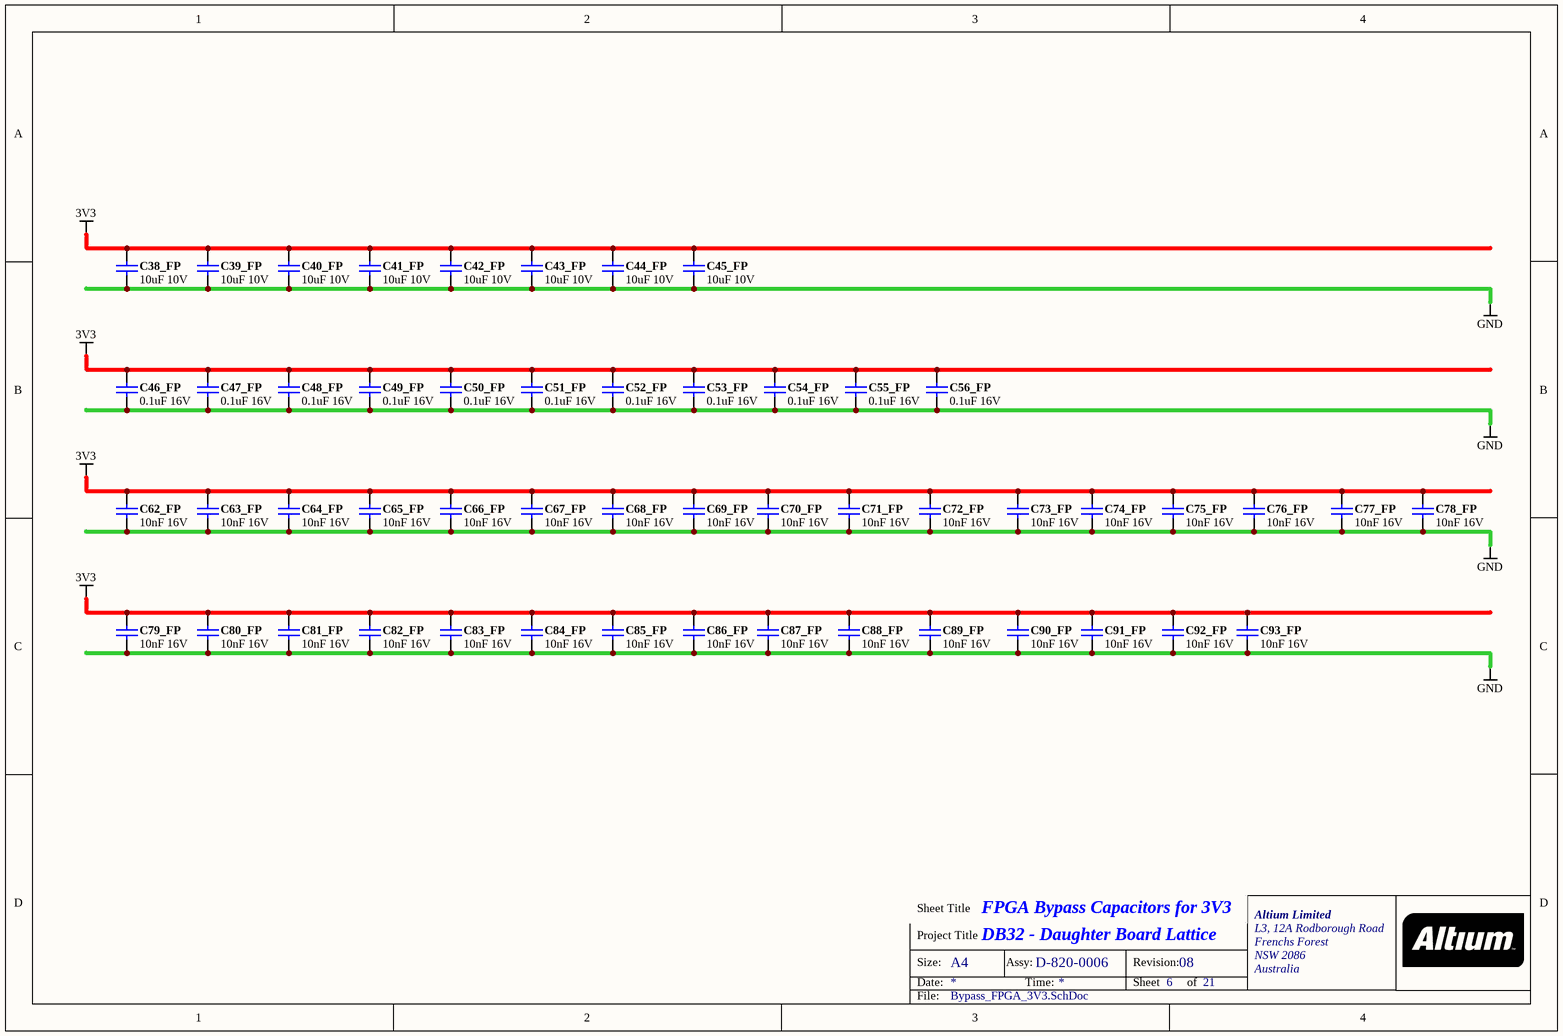
[diagram p3: Bypass_FPGA_3V3.SchDoc]

### Parts
C38_FP  10uF 10V  [CAPC2012-STAR]
C39_FP  10uF 10V  [CAPC2012-STAR]
C40_FP  10uF 10V  [CAPC2012-STAR]
C41_FP  10uF 10V  [CAPC2012-STAR]
C42_FP  10uF 10V  [CAPC2012-STAR]
C43_FP  10uF 10V  [CAPC2012-STAR]
C44_FP  10uF 10V  [CAPC2012-STAR]
C45_FP  10uF 10V  [CAPC2012-STAR]
C46_FP  0.1uF 16V  [CAPC1005-STAR]
C47_FP  0.1uF 16V  [CAPC1005-STAR]
C48_FP  0.1uF 16V  [CAPC1005-STAR]
C49_FP  0.1uF 16V  [CAPC1005-STAR]
C50_FP  0.1uF 16V  [CAPC1005-STAR]
C51_FP  0.1uF 16V  [CAPC1005-STAR]
C52_FP  0.1uF 16V  [CAPC1005-STAR]
C53_FP  0.1uF 16V  [CAPC1005-STAR]
C54_FP  0.1uF 16V  [CAPC1005-STAR]
C55_FP  0.1uF 16V  [CAPC1005-STAR]
C56_FP  0.1uF 16V  [CAPC1005-STAR]
C62_FP  10nF 16V  [CAPC1005-STAR]
C63_FP  10nF 16V  [CAPC1005-STAR]
C64_FP  10nF 16V  [CAPC1005-STAR]
C65_FP  10nF 16V  [CAPC1005-STAR]
C66_FP  10nF 16V  [CAPC1005-STAR]
C67_FP  10nF 16V  [CAPC1005-STAR]
C68_FP  10nF 16V  [CAPC1005-STAR]
C69_FP  10nF 16V  [CAPC1005-STAR]
C70_FP  10nF 16V  [CAPC1005-STAR]
C71_FP  10nF 16V  [CAPC1005-STAR]
C72_FP  10nF 16V  [CAPC1005-STAR]
C73_FP  10nF 16V  [CAPC1005-STAR]
C74_FP  10nF 16V  [CAPC1005-STAR]
C75_FP  10nF 16V  [CAPC1005-STAR]
C76_FP  10nF 16V  [CAPC1005-STAR]
C77_FP  10nF 16V  [CAPC1005-STAR]
C78_FP  10nF 16V  [CAPC1005-STAR]
C79_FP  10nF 16V  [CAPC1005-STAR]
C80_FP  10nF 16V  [CAPC1005-STAR]
C81_FP  10nF 16V  [CAPC1005-STAR]
C82_FP  10nF 16V  [CAPC1005-STAR]
C83_FP  10nF 16V  [CAPC1005-STAR]
C84_FP  10nF 16V  [CAPC1005-STAR]
C85_FP  10nF 16V  [CAPC1005-STAR]
C86_FP  10nF 16V  [CAPC1005-STAR]
C87_FP  10nF 16V  [CAPC1005-STAR]
C88_FP  10nF 16V  [CAPC1005-STAR]
C89_FP  10nF 16V  [CAPC1005-STAR]
C90_FP  10nF 16V  [CAPC1005-STAR]
C91_FP  10nF 16V  [CAPC1005-STAR]
C92_FP  10nF 16V  [CAPC1005-STAR]
C93_FP  10nF 16V  [CAPC1005-STAR]

### Nets
3V3: C38_FP.1 C39_FP.1 C40_FP.1 C41_FP.1 C42_FP.1 C43_FP.1 C44_FP.1 C45_FP.1 C46_FP.1 C47_FP.1 C48_FP.1 C49_FP.1 C50_FP.1 C51_FP.1 C52_FP.1 C53_FP.1 C54_FP.1 C55_FP.1 C56_FP.1 C62_FP.1 C63_FP.1 C64_FP.1 C65_FP.1 C66_FP.1 C67_FP.1 C68_FP.1 C69_FP.1 C70_FP.1 C71_FP.1 C72_FP.1 C73_FP.1 C74_FP.1 C75_FP.1 C76_FP.1 C77_FP.1 C78_FP.1 C79_FP.1 C80_FP.1 C81_FP.1 C82_FP.1 C83_FP.1 C84_FP.1 C85_FP.1 C86_FP.1 C87_FP.1 C88_FP.1 C89_FP.1 C90_FP.1 C91_FP.1 C92_FP.1 C93_FP.1
GND: C38_FP.2 C39_FP.2 C40_FP.2 C41_FP.2 C42_FP.2 C43_FP.2 C44_FP.2 C45_FP.2 C46_FP.2 C47_FP.2 C48_FP.2 C49_FP.2 C50_FP.2 C51_FP.2 C52_FP.2 C53_FP.2 C54_FP.2 C55_FP.2 C56_FP.2 C62_FP.2 C63_FP.2 C64_FP.2 C65_FP.2 C66_FP.2 C67_FP.2 C68_FP.2 C69_FP.2 C70_FP.2 C71_FP.2 C72_FP.2 C73_FP.2 C74_FP.2 C75_FP.2 C76_FP.2 C77_FP.2 C78_FP.2 C79_FP.2 C80_FP.2 C81_FP.2 C82_FP.2 C83_FP.2 C84_FP.2 C85_FP.2 C86_FP.2 C87_FP.2 C88_FP.2 C89_FP.2 C90_FP.2 C91_FP.2 C92_FP.2 C93_FP.2

### Notes on the sheet
- Sheet Title
- Project Title
- Size:
- Date:
- A4
- Assy:
- Time:
- Revision:
- Sheet
- of
- File:

### Library data of the parts
C38_FP C39_FP C40_FP C41_FP C42_FP C43_FP C44_FP C45_FP = D-101-0087: Capacitor, Ceramic, 10uF 10% 10V 0805 (2012) X5R; Polarity: Non-Polarized; Capacitance: 10 uF; Dielectric: X5R; Mounting Technology: Surface Mount; Rated Voltage: 10 V; Status: Unreleased; Technology: None; Tolerance: 10 %; Category: Capacitor
C46_FP C47_FP C48_FP C49_FP C50_FP C51_FP C52_FP C53_FP C54_FP C55_FP C56_FP = D-101-0080: as C2_PL on sheet FPGA_NonIO; Capacitance: 0.1 uF; Dielectric: X7R; Mounting Technology: Surface Mount; Rated Voltage: 16 V; Status: Production; Technology: Ceramic; Tolerance: 10 %; Category: Capacitor
C62_FP C63_FP C64_FP C65_FP C66_FP C67_FP C68_FP C69_FP C70_FP C71_FP C72_FP C73_FP C74_FP C75_FP C76_FP C77_FP C78_FP C79_FP C80_FP C81_FP C82_FP C83_FP C84_FP C85_FP C86_FP C87_FP C88_FP C89_FP C90_FP C91_FP C92_FP C93_FP = D-101-0077: as C3_PL on sheet FPGA_NonIO; Capacitance: 10 nF; Dielectric: X7R; Mounting Technology: Surface Mount; Rated Voltage: 16 V; Status: Production; Technology: Ceramic; Tolerance: 10 %; Category: Capacitor

## Nets that join several sheets
3V3: FPGA (7 pins), FPGA_NonIO (69 pins), Bypass_FPGA_3V3 (51 pins)
GND: FPGA (NT4.2 NT5.2), FPGA_NonIO (80 pins), Bypass_FPGA_3V3 (51 pins)
CCLK: FPGA (R26.2), FPGA_NonIO (U1.V20)
DONE: FPGA (R25.2), FPGA_NonIO (U1.U20)
INITN: FPGA (R8.2), FPGA_NonIO (U1.V25)
M0: FPGA (R23.2), FPGA_NonIO (U1.V23)
M1: FPGA (R18.2), FPGA_NonIO (U1.V21)
M2: FPGA (R28.2), FPGA_NonIO (U1.V24)
PROGRAMN: FPGA (R24.2), FPGA_NonIO (U1.V22)
TCK: FPGA (R14.2), FPGA_NonIO (U1.U7)
TDI: FPGA (R20.2), FPGA_NonIO (U1.V4)
TDO: FPGA (R22.2), FPGA_NonIO (U1.V3)
TMS: FPGA (R12.2), FPGA_NonIO (U1.V5)

## Assembly variants
Production: not fitted RN1 RN2 RN3 RN4 RN5 RN6 RN7 RN8 RN17 RN18 RN19 RN20 RN21 RN22 RN23 RN24 RN25 RN26 RN27 RN28 RN29 RN30 RN31 RN32